# EAGLE schematic fet_level_shifter (EAGLE 6.4)
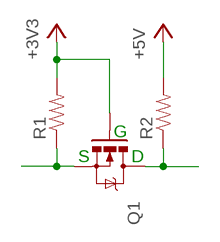
[diagram p0: schematic, sheet 1]

## Parts
Q1  MOSFET-NCHANNEL2N7000  [TO-92]
R1  RESISTOR0402-RES  [0402-RES]
R2  RESISTOR0402-RES  [0402-RES]

## Nets
+3V3: Q1.2(G) R1.2
+5V: R2.2
N$1: Q1.1(S) R1.1
N$2: Q1.3(D) R2.1

## Notes on the sheet
- G
- S | D

## Library data of the parts
Q1 = SparkFun-DiscreteSemi:MOSFET-NCHANNEL: Common NMOSFET Parts MFG P/N Store ID Prod ID FDD8780 TRANS-09984 SI7820DN TRANS-11055 FDS6630A IC-08089 2N7002PW TRANS-11151 FQP30N06L COM-10213 TRANS-10060 BSS123LT1G TRANS-08345 BSS138 TRANS-00830 BS170 2N7000
R1 R2 = SparkFun-Passives:RESISTOR: Resistor Basic schematic elements and footprints for 0603, 1206, and PTH resistors.